# EAGLE design 8x8-LED-Matrix-Standard (EAGLE 5.11)
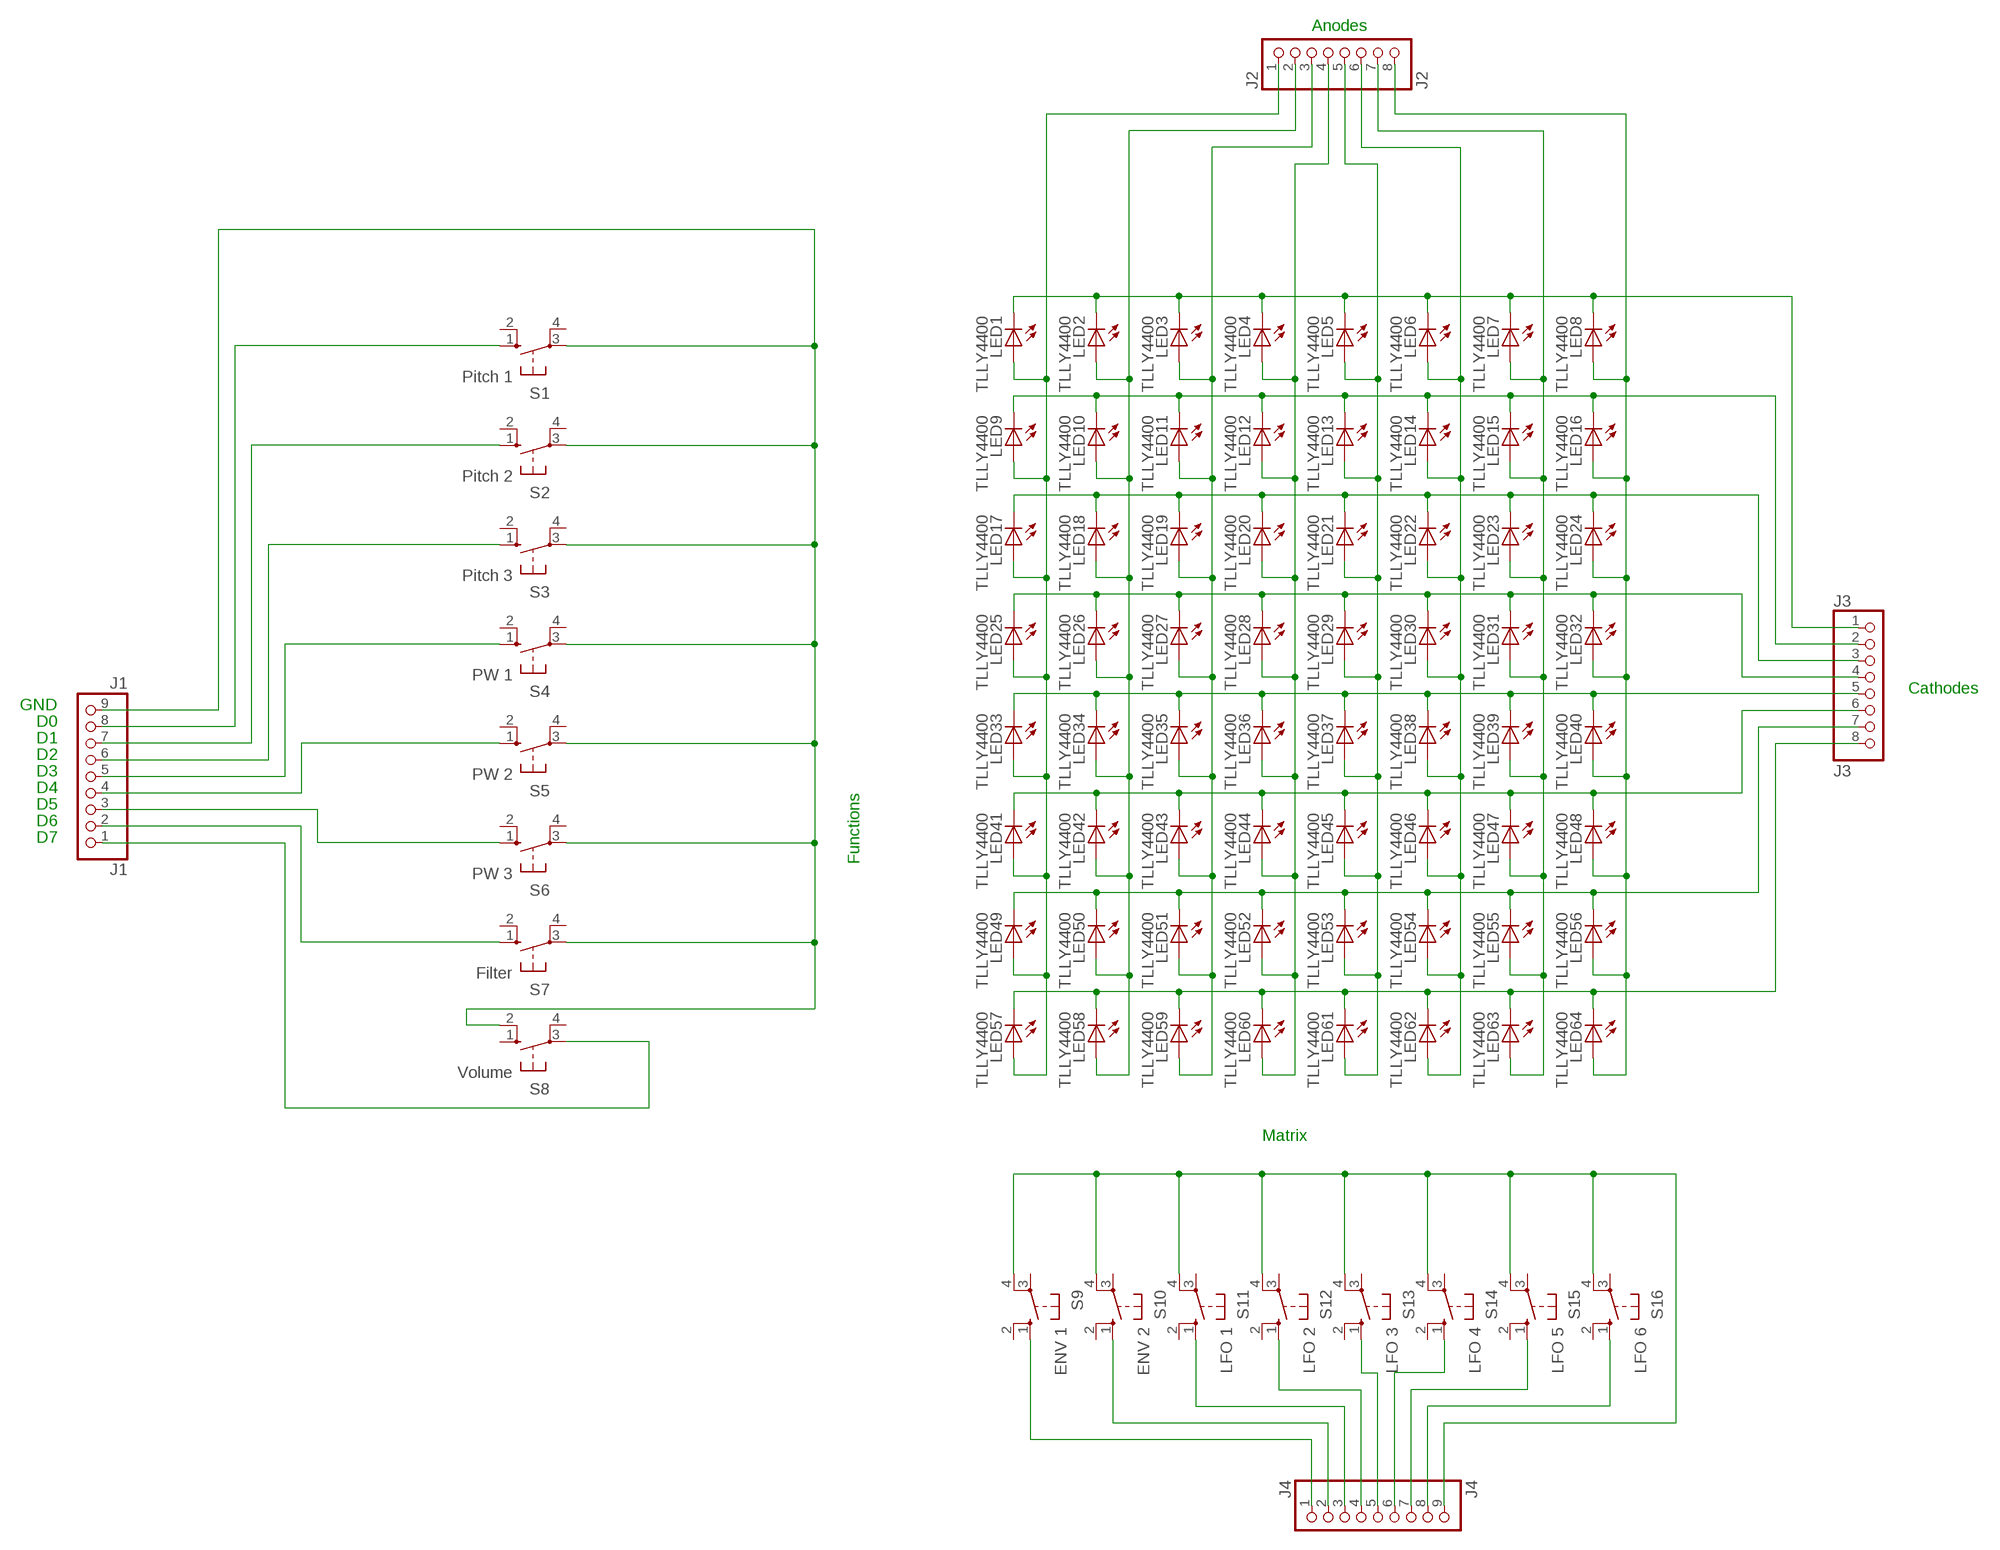
[diagram p0: schematic, sheet 1]

## Parts
J1  J1  PINHD-1X9  [1X09]
J2  J2  PINHD-1X8  [1X08]
J3  J3  PINHD-1X8  [1X08]
J4  J4  PINHD-1X9  [1X09]
LED1  TLLY4400  [LED3MM]
LED2  TLLY4400  [LED3MM]
LED3  TLLY4400  [LED3MM]
LED4  TLLY4400  [LED3MM]
LED5  TLLY4400  [LED3MM]
LED6  TLLY4400  [LED3MM]
LED7  TLLY4400  [LED3MM]
LED8  TLLY4400  [LED3MM]
LED9  TLLY4400  [LED3MM]
LED10  TLLY4400  [LED3MM]
LED11  TLLY4400  [LED3MM]
LED12  TLLY4400  [LED3MM]
LED13  TLLY4400  [LED3MM]
LED14  TLLY4400  [LED3MM]
LED15  TLLY4400  [LED3MM]
LED16  TLLY4400  [LED3MM]
LED17  TLLY4400  [LED3MM]
LED18  TLLY4400  [LED3MM]
LED19  TLLY4400  [LED3MM]
LED20  TLLY4400  [LED3MM]
LED21  TLLY4400  [LED3MM]
LED22  TLLY4400  [LED3MM]
LED23  TLLY4400  [LED3MM]
LED24  TLLY4400  [LED3MM]
LED25  TLLY4400  [LED3MM]
LED26  TLLY4400  [LED3MM]
LED27  TLLY4400  [LED3MM]
LED28  TLLY4400  [LED3MM]
LED29  TLLY4400  [LED3MM]
LED30  TLLY4400  [LED3MM]
LED31  TLLY4400  [LED3MM]
LED32  TLLY4400  [LED3MM]
LED33  TLLY4400  [LED3MM]
LED34  TLLY4400  [LED3MM]
LED35  TLLY4400  [LED3MM]
LED36  TLLY4400  [LED3MM]
LED37  TLLY4400  [LED3MM]
LED38  TLLY4400  [LED3MM]
LED39  TLLY4400  [LED3MM]
LED40  TLLY4400  [LED3MM]
LED41  TLLY4400  [LED3MM]
LED42  TLLY4400  [LED3MM]
LED43  TLLY4400  [LED3MM]
LED44  TLLY4400  [LED3MM]
LED45  TLLY4400  [LED3MM]
LED46  TLLY4400  [LED3MM]
LED47  TLLY4400  [LED3MM]
LED48  TLLY4400  [LED3MM]
LED49  TLLY4400  [LED3MM]
LED50  TLLY4400  [LED3MM]
LED51  TLLY4400  [LED3MM]
LED52  TLLY4400  [LED3MM]
LED53  TLLY4400  [LED3MM]
LED54  TLLY4400  [LED3MM]
LED55  TLLY4400  [LED3MM]
LED56  TLLY4400  [LED3MM]
LED57  TLLY4400  [LED3MM]
LED58  TLLY4400  [LED3MM]
LED59  TLLY4400  [LED3MM]
LED60  TLLY4400  [LED3MM]
LED61  TLLY4400  [LED3MM]
LED62  TLLY4400  [LED3MM]
LED63  TLLY4400  [LED3MM]
LED64  TLLY4400  [LED3MM]
S1  Pitch 1  10-XX  [B3F-10XX]
S2  Pitch 2  10-XX  [B3F-10XX]
S3  Pitch 3  10-XX  [B3F-10XX]
S4  PW 1  10-XX  [B3F-10XX]
S5  PW 2  10-XX  [B3F-10XX]
S6  PW 3  10-XX  [B3F-10XX]
S7  Filter  10-XX  [B3F-10XX]
S8  Volume  10-XX  [B3F-10XX]
S9  ENV 1  10-XX  [B3F-10XX]
S10  ENV 2  10-XX  [B3F-10XX]
S11  LFO 1  10-XX  [B3F-10XX]
S12  LFO 2  10-XX  [B3F-10XX]
S13  LFO 3  10-XX  [B3F-10XX]
S14  LFO 4  10-XX  [B3F-10XX]
S15  LFO 5  10-XX  [B3F-10XX]
S16  LFO 6  10-XX  [B3F-10XX]

## Nets
GND1: J1.9 S1.3(P) S2.3(P) S3.3(P) S4.3(P) S5.3(P) S6.3(P) S7.3(P) S8.2(S1)
GND2: J4.9 S9.4(P1) S10.4(P1) S11.4(P1) S12.4(P1) S13.4(P1) S14.4(P1) S15.4(P1) S16.4(P1)
N$7: J2.1 LED1.A LED9.A LED17.A LED25.A LED33.A LED41.A LED49.A LED57.A
N$10: J2.3 LED3.A LED11.A LED19.A LED27.A LED35.A LED43.A LED51.A LED59.A
N$11: J2.2 LED2.A LED10.A LED18.A LED26.A LED34.A LED42.A LED50.A LED58.A
N$18: J4.1 S9.1(S)
N$19: J4.2 S10.1(S)
N$20: J4.4 S12.1(S)
N$21: J4.5 S13.1(S)
N$22: J4.6 S14.1(S)
N$23: J4.7 S15.1(S)
N$24: J4.8 S16.1(S)
N$25: J4.3 S11.1(S)
N$26: J2.4 LED4.A LED12.A LED20.A LED28.A LED36.A LED44.A LED52.A LED60.A
N$27: J2.5 LED5.A LED13.A LED21.A LED29.A LED37.A LED45.A LED53.A LED61.A
N$28: J2.6 LED6.A LED14.A LED22.A LED30.A LED38.A LED46.A LED54.A LED62.A
N$29: J2.7 LED7.A LED15.A LED23.A LED31.A LED39.A LED47.A LED55.A LED63.A
N$30: J2.8 LED8.A LED16.A LED24.A LED32.A LED40.A LED48.A LED56.A LED64.A
N$32: J1.4 S5.1(S)
N$33: J1.3 S6.1(S)
N$34: J3.1 LED1.K(C) LED2.K(C) LED3.K(C) LED4.K(C) LED5.K(C) LED6.K(C) LED7.K(C) LED8.K(C)
N$35: J1.2 S7.1(S)
N$36: J1.1 S8.3(P)
N$37: J1.5 S4.1(S)
N$38: J1.6 S3.1(S)
N$39: J1.7 S2.1(S)
N$40: J3.2 LED9.K(C) LED10.K(C) LED11.K(C) LED12.K(C) LED13.K(C) LED14.K(C) LED15.K(C) LED16.K(C)
N$42: J1.8 S1.1(S)
N$43: J3.3 LED17.K(C) LED18.K(C) LED19.K(C) LED20.K(C) LED21.K(C) LED22.K(C) LED23.K(C) LED24.K(C)
N$44: J3.4 LED25.K(C) LED26.K(C) LED27.K(C) LED28.K(C) LED29.K(C) LED30.K(C) LED31.K(C) LED32.K(C)
N$45: J3.6 LED41.K(C) LED42.K(C) LED43.K(C) LED44.K(C) LED45.K(C) LED46.K(C) LED47.K(C) LED48.K(C)
N$46: J3.7 LED49.K(C) LED50.K(C) LED51.K(C) LED52.K(C) LED53.K(C) LED54.K(C) LED55.K(C) LED56.K(C)
N$47: J3.8 LED57.K(C) LED58.K(C) LED59.K(C) LED60.K(C) LED61.K(C) LED62.K(C) LED63.K(C) LED64.K(C)
N$48: J3.5 LED33.K(C) LED34.K(C) LED35.K(C) LED36.K(C) LED37.K(C) LED38.K(C) LED39.K(C) LED40.K(C)
Unconnected: S1.2(S1) S1.4(P1) S2.2(S1) S2.4(P1) S3.2(S1) S3.4(P1) S4.2(S1) S4.4(P1) S5.2(S1) S5.4(P1) S6.2(S1) S6.4(P1) S7.2(S1) S7.4(P1) S8.1(S) S8.4(P1) S9.2(S1) S9.3(P) S10.2(S1) S10.3(P) S11.2(S1) S11.3(P) S12.2(S1) S12.3(P) S13.2(S1) S13.3(P) S14.2(S1) S14.3(P) S15.2(S1) S15.3(P) S16.2(S1) S16.3(P)

## Notes on the sheet
- Anodes
- Cathodes
- GND
- D0
- D1
- D2
- D3
- D4 | Functions
- D5
- D6
- D7
- Matrix

## Library data of the parts
J1 J4 = pinhead:PINHD-1X9: PIN HEADER
J2 J3 = pinhead:PINHD-1X8: PIN HEADER
LED1-LED64 = led:TLLY4400: Low Current (2mA) LED 3 mm Tinted Diffused Package color YELLOW Source: Data sheet <http://www.farnell.com/datasheets/391098.pdf>; MF: VISHAY SEMICONDUCTOR; OC_FARNELL: 1612439
S1-S16 = switch-omron:10-XX: OMRON SWITCH; MPN: B3F-1000; OC_FARNELL: 176432; OC_NEWARK: 36M3542

## Board
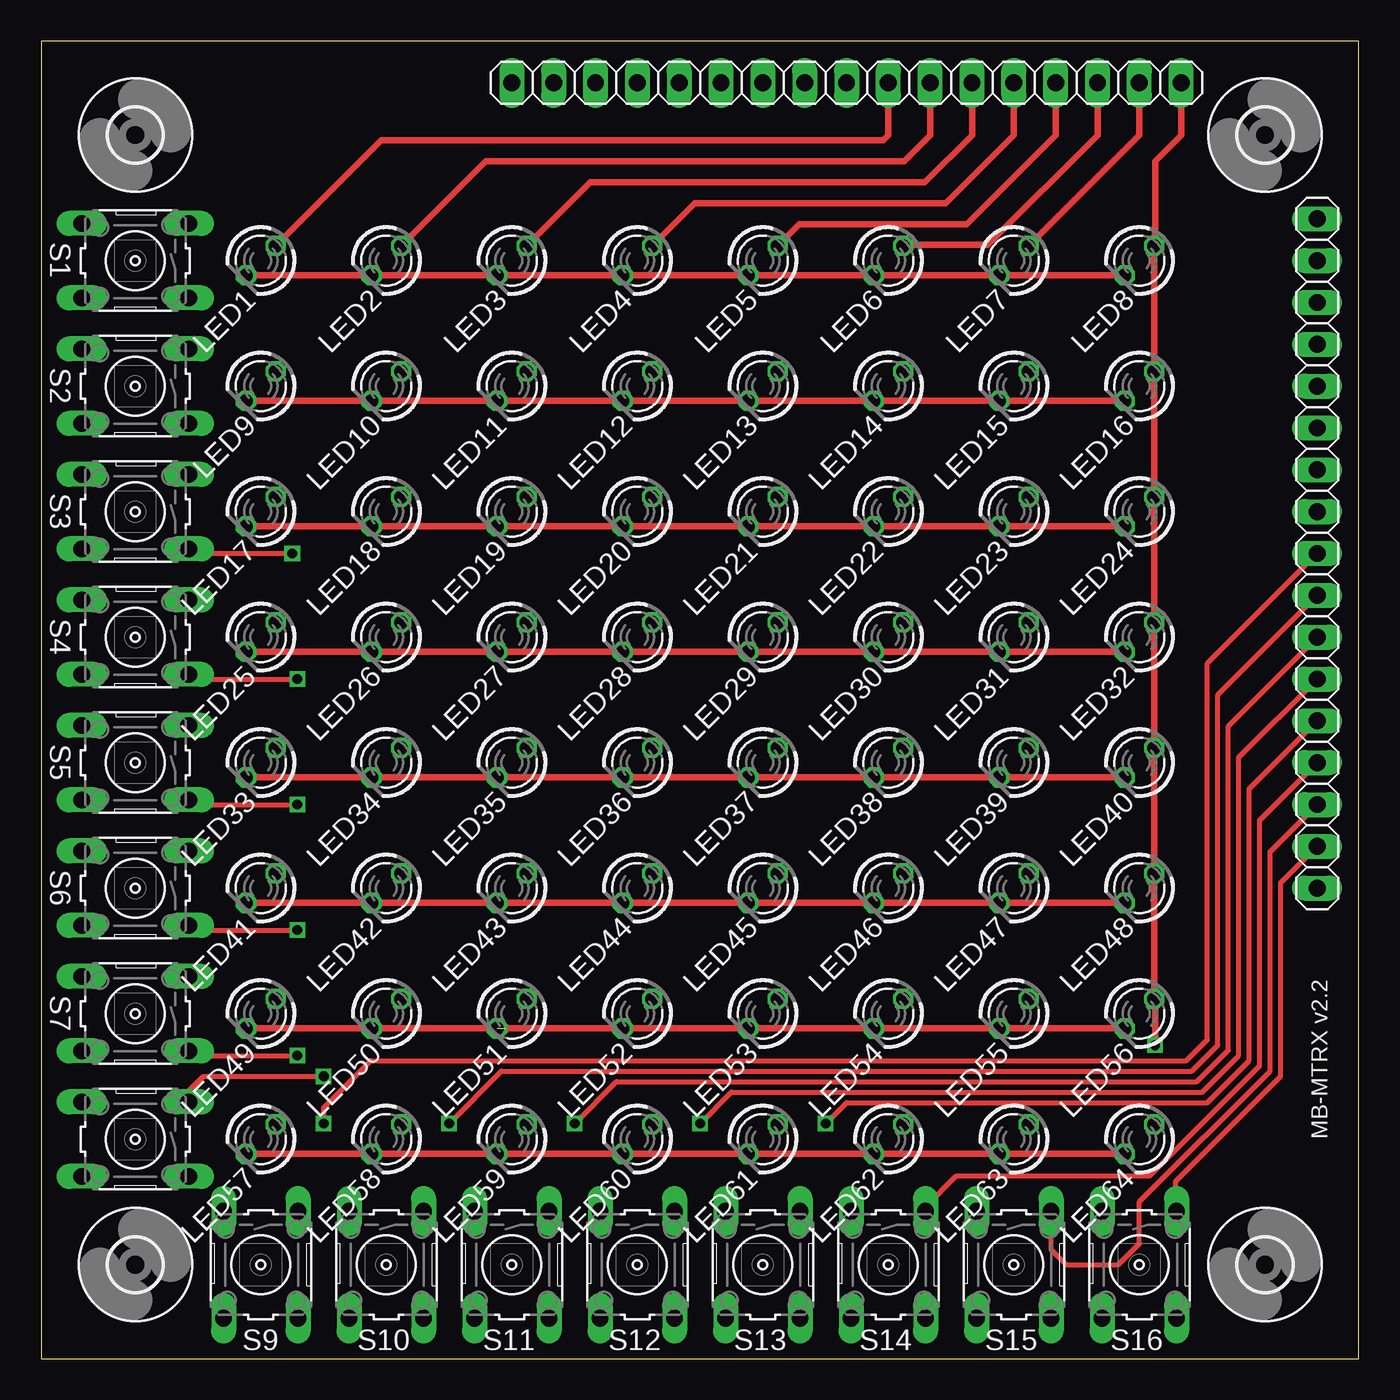
[diagram p1: board, top side]
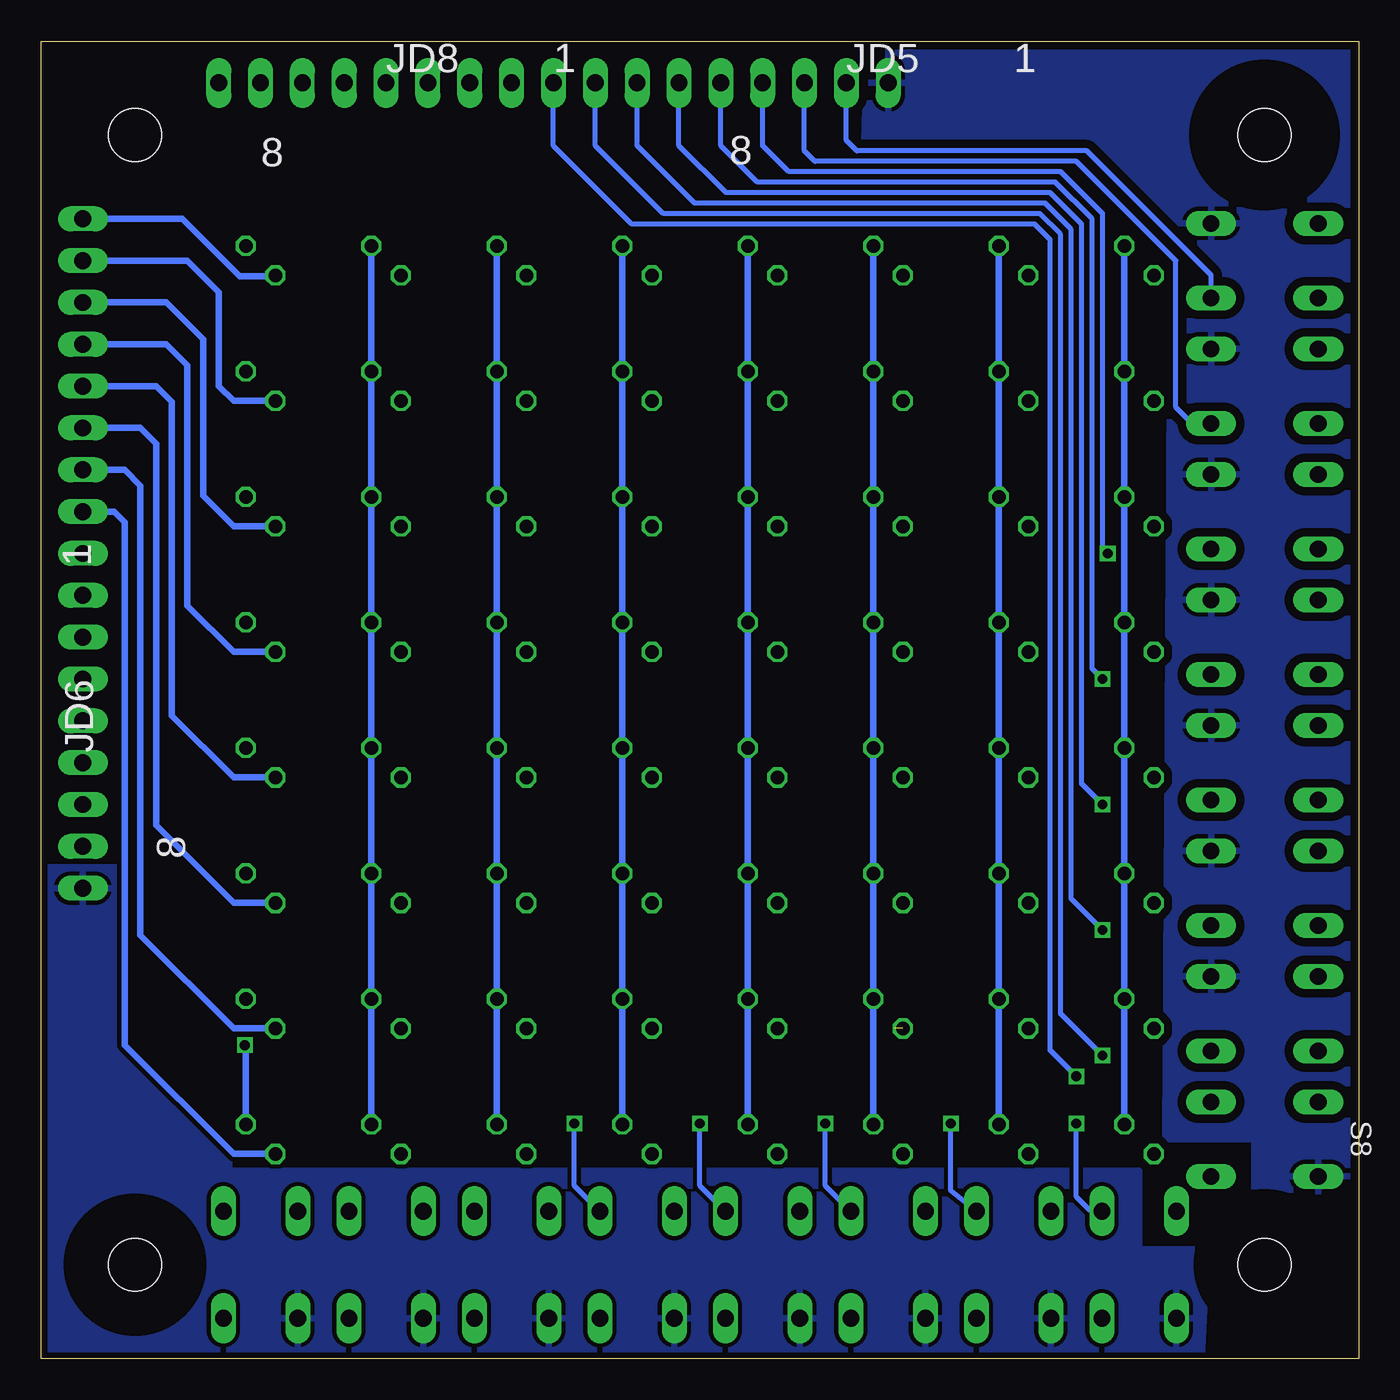
[diagram p2: board, bottom side, seen from below]

Size 80 x 80 mm. Coordinates in mm from the lower left corner, seen from the top.
Outline: 0,0 80,0 80,80 0,80 0,0
Copper layers (1*16): Top 0.0356mm / dielectric 1.5011mm / Bottom 0.0356mm
Design rules "LaenPCBOrder": minimum track width 6mil, minimum drill 13mil, track to track 6mil, track to pad 6mil, pad to pad 6mil, via to via 6mil, smd to smd 6mil, copper to edge 15mil, drill to drill 6mil, minimum pad ring 7mil, minimum via ring 7mil, stop-mask expansion 4mil, vias tented up to drill 0mil, thermal gap 10mil

### Footprints (pad centres in the part's own frame; a part is rotated, then mirrored left to right if it is on the bottom)
1X09 = drill 1.016 long: 1 -10.16,0; 2 -7.62,0; 3 -5.08,0; 4 -2.54,0; 5 0,0; 6 2.54,0; 7 5.08,0; 8 7.62,0; 9 10.16,0
1X08 = drill 1.016 long: 1 -8.89,0; 2 -6.35,0; 3 -3.81,0; 4 -1.27,0; 5 1.27,0; 6 3.81,0; 7 6.35,0; 8 8.89,0
LED3MM = drill 0.813 octagon: A -1.27,0; K 1.27,0
B3F-10XX = drill 1.016 long: 1 -3.251,2.261; 2 3.251,2.261; 3 -3.251,-2.261; 4 3.251,-2.261
3,2 = hole 3.2: 0,0

### Placement (x,y rotation side)
J1  38.73,77.47 180 top
J2  60.33,77.47 0 top
J3  77.47,60.33 270 top
J4  77.47,38.73 270 top
LED1  13.34,66.67 225 top
LED2  20.95,66.67 225 top
LED3  28.57,66.67 225 top
LED4  36.2,66.67 225 top
LED5  43.81,66.67 225 top
LED6  51.44,66.67 225 top
LED7  59.05,66.67 225 top
LED8  66.67,66.67 225 top
LED9  13.34,59.05 225 top
LED10  20.95,59.05 225 top
LED11  28.57,59.05 225 top
LED12  36.2,59.05 225 top
LED13  43.81,59.05 225 top
LED14  51.44,59.05 225 top
LED15  59.05,59.05 225 top
LED16  66.67,59.05 225 top
LED17  13.34,51.44 225 top
LED18  20.95,51.44 225 top
LED19  28.57,51.44 225 top
LED20  36.2,51.44 225 top
LED21  43.81,51.44 225 top
LED22  51.44,51.44 225 top
LED23  59.05,51.44 225 top
LED24  66.67,51.44 225 top
LED25  13.34,43.81 225 top
LED26  20.95,43.81 225 top
LED27  28.57,43.81 225 top
LED28  36.2,43.81 225 top
LED29  43.81,43.81 225 top
LED30  51.44,43.81 225 top
LED31  59.05,43.81 225 top
LED32  66.67,43.81 225 top
LED33  13.34,36.2 225 top
LED34  20.95,36.2 225 top
LED35  28.57,36.2 225 top
LED36  36.2,36.2 225 top
LED37  43.81,36.2 225 top
LED38  51.44,36.2 225 top
LED39  59.05,36.2 225 top
LED40  66.67,36.2 225 top
LED41  13.34,28.57 225 top
LED42  20.95,28.57 225 top
LED43  28.57,28.57 225 top
LED44  36.2,28.57 225 top
LED45  43.81,28.57 225 top
LED46  51.44,28.57 225 top
LED47  59.05,28.57 225 top
LED48  66.67,28.57 225 top
LED49  13.34,20.95 225 top
LED50  20.95,20.95 225 top
LED51  28.57,20.95 225 top
LED52  36.2,20.95 225 top
LED53  43.81,20.95 225 top
LED54  51.44,20.95 225 top
LED55  59.05,20.95 225 top
LED56  66.67,20.95 225 top
LED57  13.34,13.34 225 top
LED58  20.95,13.34 225 top
LED59  28.57,13.34 225 top
LED60  36.2,13.34 225 top
LED61  43.81,13.34 225 top
LED62  51.44,13.34 225 top
LED63  59.05,13.34 225 top
LED64  66.67,13.34 225 top
S1  5.71,66.67 180 top
S2  5.71,59.05 180 top
S3  5.71,51.44 180 top
S4  5.71,43.81 180 top
S5  5.71,36.2 180 top
S6  5.71,28.57 180 top
S7  5.71,20.95 180 top
S8  5.71,13.34 180 top
S9  13.34,5.71 270 top
S10  20.95,5.71 270 top
S11  28.57,5.71 270 top
S12  36.2,5.71 270 top
S13  43.81,5.71 270 top
S14  51.44,5.71 270 top
S15  59.05,5.71 270 top
S16  66.67,5.71 270 top
U$1  [3,2]  5.71,74.3 0 top
U$2  [3,2]  74.3,74.3 0 top
U$3  [3,2]  74.3,5.71 0 top
U$4  [3,2]  5.71,5.71 0 top

### Tracks (layer width: path | path; a pad name or v marks a point on that pad's centre or on a via)
GND1
  pour Bottom (isolate 0.508): 30.16,68.9 11.43,68.9 11.75,13.34 6.35,13.34 6.35,10.16 0,10.16 0,80.01 29.84,80.01
GND2
  pour Bottom (isolate 0.254): 80.01,0 80.01,29.84 68.58,29.84 68.58,11.43 13.34,11.43 13.34,6.67 9.21,6.67 9.53,0
N$7
  Top 0.406: J2.1 51.44,74.3 51.12,73.98 20.64,73.98 LED1.A
  Bottom 0.406: LED1.A LED9.A LED17.A LED25.A LED33.A LED41.A LED49.A LED57.A
N$10
  Top 0.406: J2.3 56.52,74.3 53.66,71.44 33.34,71.44 LED3.A
  Bottom 0.406: LED3.A LED11.A LED19.A LED27.A LED35.A LED43.A LED51.A LED59.A
N$11
  Top 0.406: J2.2 53.98,74.3 52.39,72.71 26.99,72.71 LED2.A
  Bottom 0.406: LED2.A LED10.A LED18.A LED26.A LED34.A LED42.A LED50.A LED58.A
N$18  (via drill 0.6)
  Top 0.305: v17.14,14.29 17.14,15.24 20,18.1 69.53,18.1 70.8,19.37 70.8,42.23 J4.1
  Bottom 0.305: S9.1 16.27,8.97 17.14,9.84 v17.14,14.29
N$19  (via drill 0.6)
  Top 0.305: v24.77,14.29 27.94,17.46 69.85,17.46 71.44,19.05 71.44,40.32 J4.2
  Bottom 0.305: v24.77,14.29 24.77,10.2 S10.1
N$20  (via drill 0.6)
  Top 0.305: v40.01,14.29 41.91,16.19 70.48,16.19 72.71,18.41 72.71,36.51 J4.4
  Bottom 0.305: v40.01,14.29 40.01,10.52 S12.1
N$21  (via drill 0.6)
  Top 0.305: v47.62,14.29 48.9,15.56 70.8,15.56 73.34,18.1 73.34,34.61 J4.5
  Bottom 0.305: v47.62,14.29 47.62,10.52 S13.1
N$22
  Top 0.305: S14.1 53.7,9.25 55.56,11.11 67.31,11.11 73.98,17.78 73.98,32.7 J4.6
N$23
  Top 0.305: S15.1 61.32,6.63 62.23,5.71 65.41,5.71 66.67,6.99 66.67,9.53 74.61,17.46 74.61,30.8 J4.7
N$24
  Top 0.305: J4.8 75.25,28.89 75.25,17.14 68.9,10.79 68.9,9 S16.1
N$25  (via drill 0.6)
  Top 0.305: v32.38,14.29 34.92,16.83 70.17,16.83 72.07,18.73 72.07,38.42 J4.3
  Bottom 0.305: 31.11,9.25 S11.1 32.38,10.52 v32.38,14.29
N$26
  Top 0.406: J2.4 59.05,74.3 54.93,70.17 39.69,70.17 LED4.A
  Bottom 0.406: LED4.A LED12.A LED20.A LED28.A LED36.A LED44.A LED52.A LED60.A
N$27
  Top 0.406: J2.5 61.59,74.3 56.2,68.9 46.04,68.9 LED5.A
  Bottom 0.406: LED61.A LED53.A LED45.A LED37.A LED29.A LED21.A LED13.A LED5.A
N$28
  Top 0.406: J2.6 64.14,74.3 57.47,67.63 52.39,67.63 LED6.A
  Bottom 0.406: LED62.A LED54.A LED46.A LED38.A LED30.A LED22.A LED14.A LED6.A
N$29
  Top 0.406: J2.7 66.67,74.3 LED7.A
  Bottom 0.406: LED7.A LED15.A LED23.A LED31.A LED39.A LED47.A LED55.A LED63.A
N$30  (via drill 0.6)
  Top 0.406: J2.8 69.22,74.3 67.63,72.71 67.63,67.63 LED8.A LED16.A LED24.A LED32.A LED40.A LED48.A LED56.A 67.63,21.8 v67.63,19.05
  Bottom 0.406: LED64.A 67.57,19 v67.63,19.05
N$32  (via drill 0.6)
  Top 0.305: S5.1 8.97,33.9 9.21,33.66 v15.56,33.66
  Bottom 0.305: v15.56,33.66 16.83,34.92 16.83,68.9 18.73,70.8 38.42,70.8 41.27,73.66 J1.4
N$33  (via drill 0.6)
  Top 0.305: S6.1 8.97,26.28 9.21,26.04 v15.56,26.04
  Bottom 0.305: v15.56,26.04 17.46,27.94 17.46,68.58 19.05,70.17 40.32,70.17 43.81,73.66 J1.3
N$34
  Top 0.406: LED8.K LED7.K LED6.K LED5.K LED4.K LED3.K LED2.K LED1.K
  Bottom 0.406: J3.1 71.44,69.22 67.94,65.72 65.83,65.72 LED8.K
N$35  (via drill 0.6)
  Top 0.305: S7.1 8.97,18.66 9.21,18.41 v15.56,18.41
  Bottom 0.305: v15.56,18.41 18.1,20.95 18.1,68.26 19.37,69.53 42.23,69.53 46.35,73.66 J1.2
N$36  (via drill 0.6)
  Top 0.305: v17.14,17.14 9.84,17.14 8.97,16.27 S8.3
  Bottom 0.305: v17.14,17.14 18.73,18.73 18.73,67.94 19.68,68.9 44.13,68.9 48.9,73.66 J1.1
N$37  (via drill 0.6)
  Top 0.305: S4.1 8.97,41.52 9.21,41.27 v15.56,41.27
  Bottom 0.305: v15.56,41.27 16.19,41.91 16.19,69.22 18.41,71.44 36.51,71.44 38.73,73.66 J1.5
N$38  (via drill 0.6)
  Top 0.305: v15.24,48.9 9.25,48.9 S3.1
  Bottom 0.305: J1.6 36.2,73.66 34.61,72.07 18.1,72.07 15.56,69.53 15.56,49.21 v15.24,48.9
N$39
  Bottom 0.305: J1.7 33.66,73.34 33.02,72.71 17.14,72.71 11.11,66.67 11.11,57.78 10.16,56.83 9,56.83 S2.1
N$40
  Top 0.406: LED9.K LED10.K LED11.K LED12.K LED13.K LED14.K LED15.K LED16.K
  Bottom 0.406: LED16.K 68.32,58.16 69.22,59.05 69.22,64.77 71.12,66.67 J3.2
N$42
  Bottom 0.305: S1.1 8.97,65.8 16.51,73.34 30.48,73.34 31.11,73.98 J1.8
N$43
  Top 0.406: LED24.K LED23.K LED22.K LED21.K LED20.K LED19.K LED18.K LED17.K
  Bottom 0.406: LED24.K 68.32,50.54 70.17,52.39 70.17,61.91 72.39,64.14 J3.3
N$44
  Top 0.406: LED25.K LED26.K LED27.K LED28.K LED29.K LED30.K LED31.K LED32.K
  Bottom 0.406: J3.4 72.39,61.59 71.12,60.33 71.12,45.72 68.32,42.92 LED32.K
N$45
  Top 0.406: LED41.K LED42.K LED43.K LED44.K LED45.K LED46.K LED47.K LED48.K
  Bottom 0.406: LED48.K 68.32,27.68 73.03,32.38 73.03,55.56 73.98,56.52 J3.6
N$46  (1 unrouted)
  Top 0.406: LED49.K LED50.K 28.2,20.06 28.26,20 28.31,20.06 LED52.K LED53.K LED54.K LED55.K LED56.K
  Bottom 0.406: LED56.K 68.32,20.06 73.98,25.72 73.98,53.02 74.93,53.98 J3.7
N$47
  Top 0.406: LED64.K LED63.K LED62.K LED61.K LED60.K LED59.K LED58.K LED57.K
  Bottom 0.406: LED64.K 68.32,12.44 74.93,19.05 74.93,50.8 75.56,51.44 J3.8
N$48
  Top 0.406: LED40.K LED39.K LED38.K LED37.K LED36.K LED35.K LED34.K LED33.K
  Bottom 0.406: LED40.K 68.32,35.3 72.07,39.05 72.07,58.1 73.03,59.05 J3.5

### Text on the board
tPlace: MB-MTRX v2.2
bPlace: 1 | JD5 | 1 | JD8 | 8 | 8 | 1 | JD6 | 8
tOrigins: P1 | P2 | P3 | W1 | W2 | W3 | F | V | A7 | A6 | A5 | A4 | A3 | A2 | A1 | A0 | GND | C7 | C6 | C5 | C4 | C3 | C2 | C1 | C0 | E1 | E2 | L1 | L2 | L3 | L4 | L5 | L6 | GND